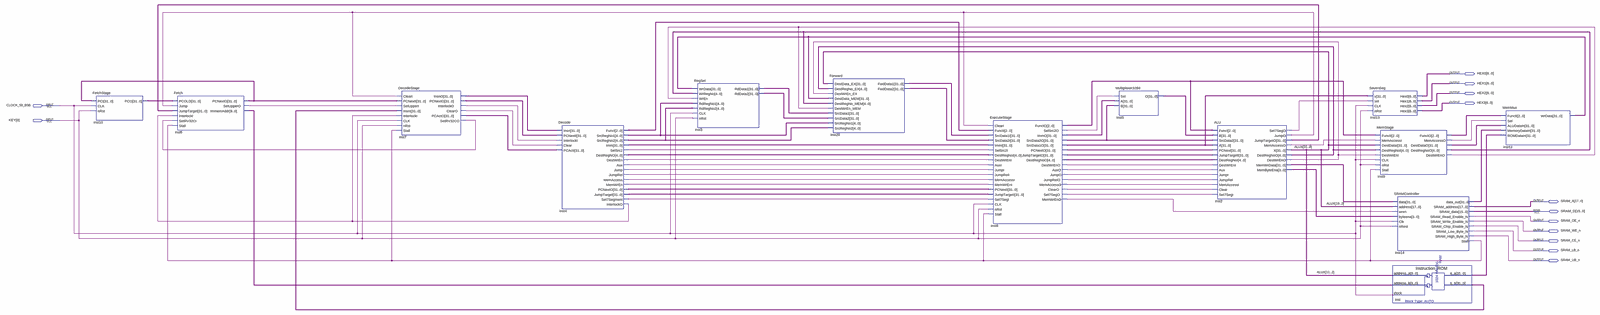
[diagram p0: schematic sheet, whole]
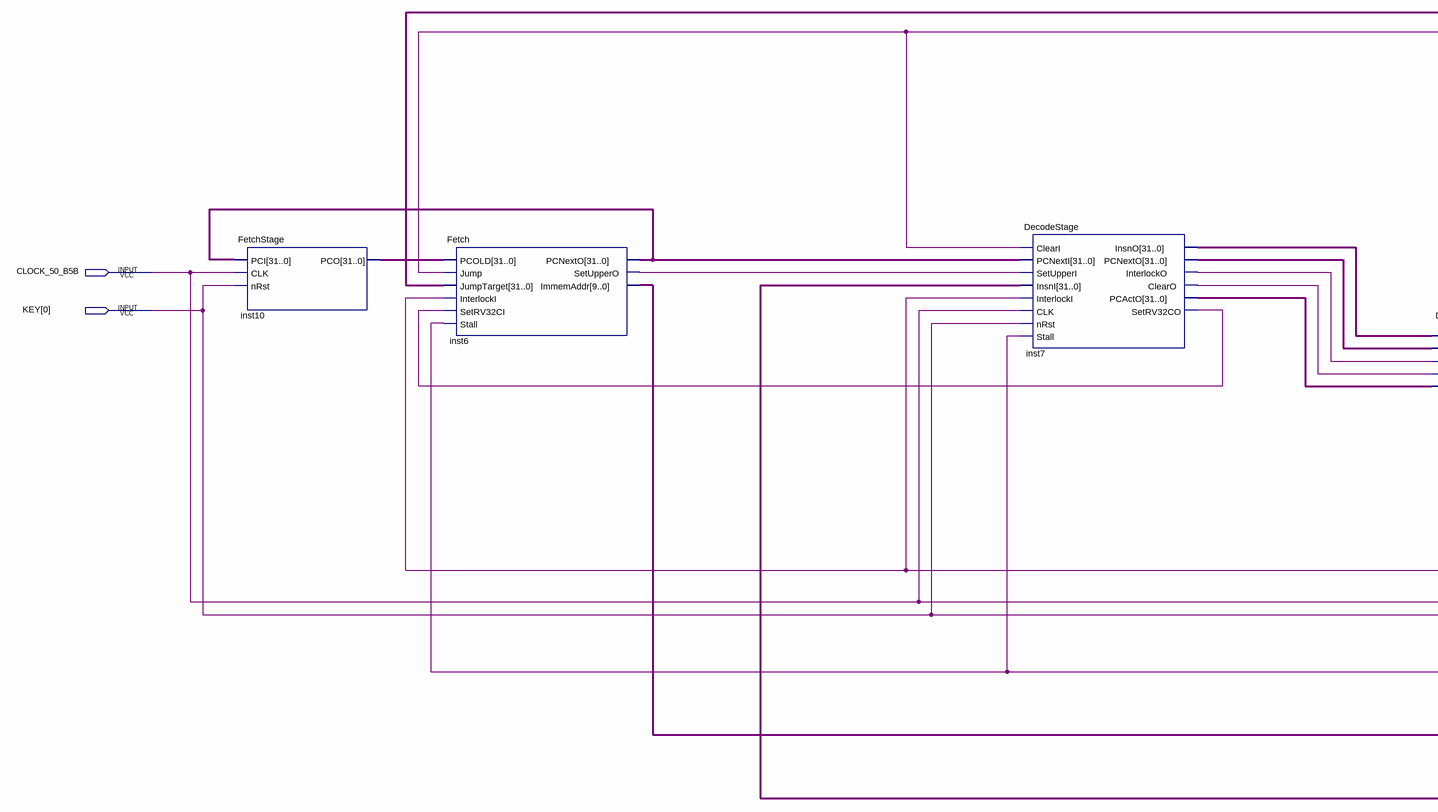
[diagram p1: schematic sheet, left part]
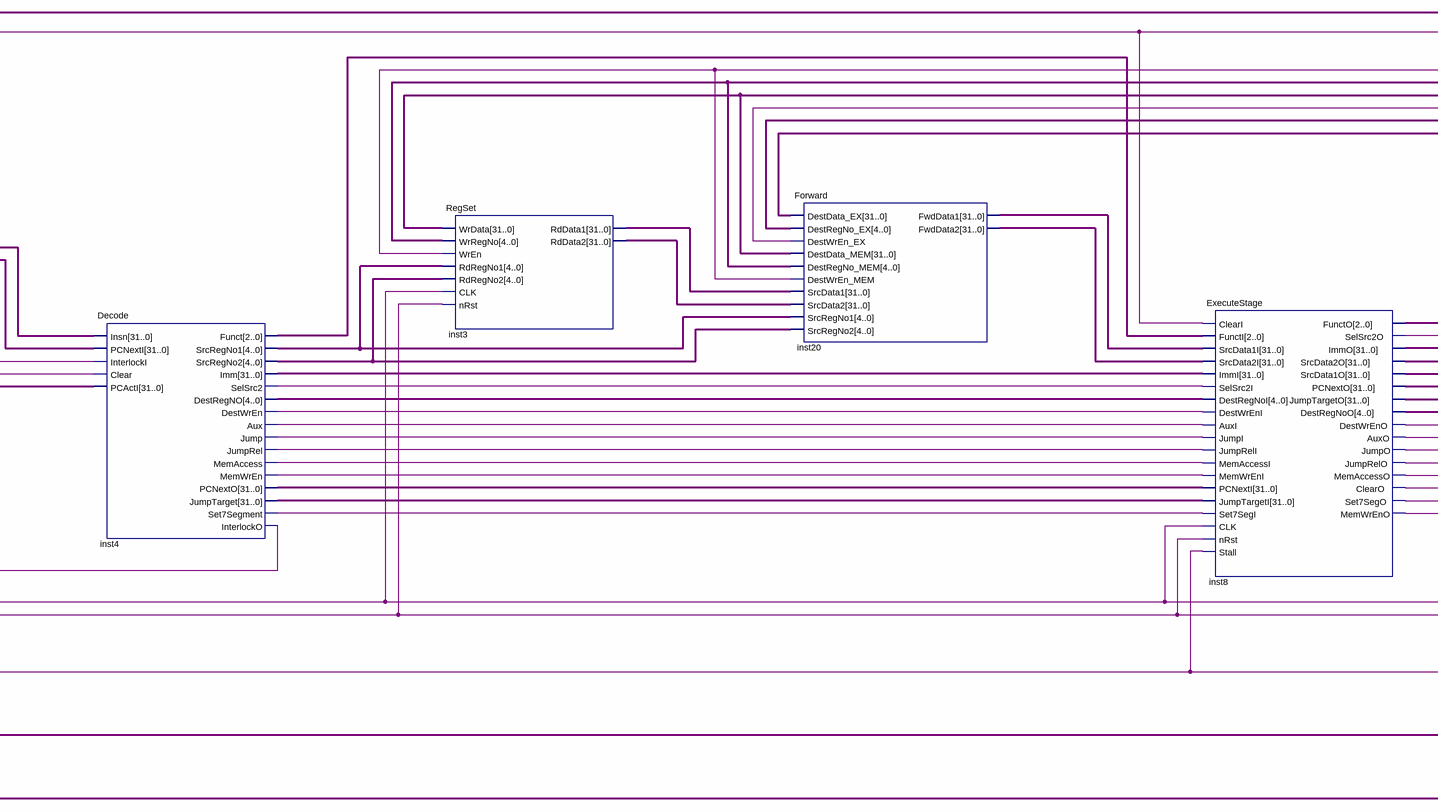
[diagram p2: schematic sheet, centre part]
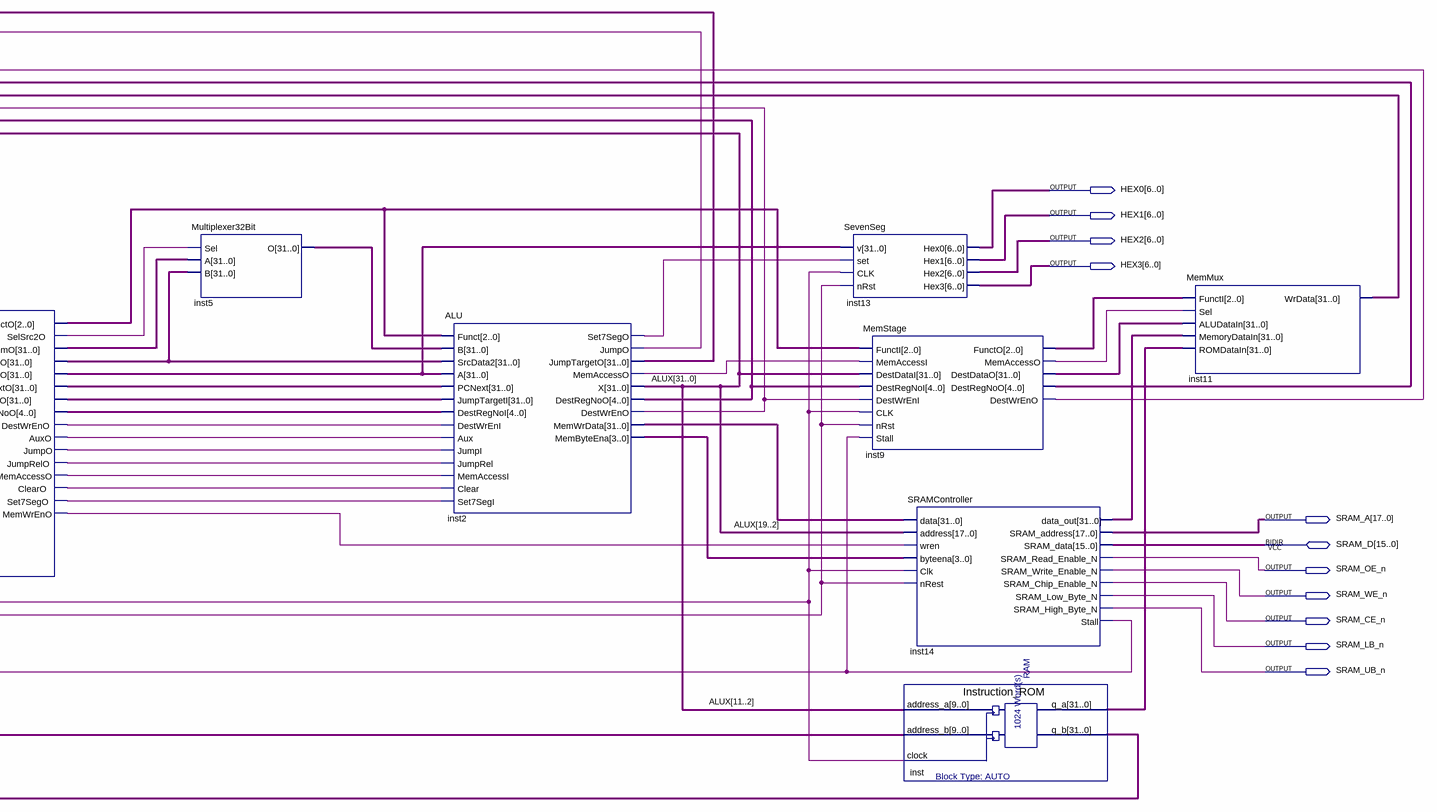
[diagram p3: schematic sheet, right part]
// Quartus schematic RISCV.bdf as structural Verilog: 14 symbols, 13 pins
module RISCV (
  input  CLOCK_50_B5B,
  input  [0:0] KEY,
  inout  [15:0] SRAM_D,
  output [6:0] HEX0,
  output [6:0] HEX1,
  output [6:0] HEX2,
  output [6:0] HEX3,
  output [17:0] SRAM_A,
  output SRAM_OE_n,
  output SRAM_WE_n,
  output SRAM_CE_n,
  output SRAM_LB_n,
  output SRAM_UB_n
);

  wire inst2_destwreno, inst2_jumpo, inst2_memaccesso, inst2_set7sego, inst4_aux, inst4_destwren,
       inst4_interlocko, inst4_jump, inst4_jumprel, inst4_memaccess, inst4_memwren, inst4_selsrc2,
       inst4_set7segment, inst6_setuppero, inst7_clearo, inst7_interlocko, inst7_setrv32co, inst8_auxo,
       inst8_clearo, inst8_destwreno, inst8_jumpo, inst8_jumprelo, inst8_memaccesso, inst8_memwreno,
       inst8_selsrc2o, inst8_set7sego, inst9_destwreno, inst9_memaccesso, inst14_stall;
  wire [2:0] inst4_funct, inst8_functo, inst9_functo;
  wire [3:0] inst2_membyteena;
  wire [4:0] inst2_destregnoo, inst4_destregno, inst4_srcregno1, inst4_srcregno2, inst8_destregnoo,
       inst9_destregnoo;
  wire [9:0] inst6_immemaddr;
  wire [31:0] ALUX, inst2_jumptargeto, inst2_memwrdata, inst3_rddata1, inst3_rddata2, inst4_imm,
       inst4_jumptarget, inst4_pcnexto, inst5_o, inst6_pcnexto, inst7_insno, inst7_pcacto, inst7_pcnexto,
       inst8_immo, inst8_jumptargeto, inst8_pcnexto, inst8_srcdata1o, inst8_srcdata2o, inst9_destdatao,
       inst10_pco, inst11_wrdata, inst14_data_out, inst20_fwddata1, inst20_fwddata2, inst_q_a, inst_q_b;

  FetchStage inst10 (.PCI(inst6_pcnexto), .CLK(CLOCK_50_B5B), .nRst(KEY[0]), .PCO(inst10_pco));
  Fetch inst6 (
    .PCOLD(inst10_pco), .Jump(inst2_jumpo), .JumpTarget(inst2_jumptargeto), .InterlockI(inst4_interlocko),
    .SetRV32CI(inst7_setrv32co), .Stall(inst14_stall), .PCNextO(inst6_pcnexto), .SetUpperO(inst6_setuppero),
    .ImmemAddr(inst6_immemaddr));
  DecodeStage inst7 (
    .ClearI(inst2_jumpo), .PCNextI(inst6_pcnexto), .SetUpperI(inst6_setuppero), .InsnI(inst_q_b),
    .InterlockI(inst4_interlocko), .CLK(CLOCK_50_B5B), .nRst(KEY[0]), .Stall(inst14_stall),
    .InsnO(inst7_insno), .PCNextO(inst7_pcnexto), .InterlockO(inst7_interlocko), .ClearO(inst7_clearo),
    .PCActO(inst7_pcacto), .SetRV32CO(inst7_setrv32co));
  Decode inst4 (
    .Insn(inst7_insno), .PCNextI(inst7_pcnexto), .InterlockI(inst7_interlocko), .Clear(inst7_clearo),
    .PCActI(inst7_pcacto), .Funct(inst4_funct), .SrcRegNo1(inst4_srcregno1), .SrcRegNo2(inst4_srcregno2),
    .Imm(inst4_imm), .SelSrc2(inst4_selsrc2), .DestRegNO(inst4_destregno), .DestWrEn(inst4_destwren),
    .Aux(inst4_aux), .Jump(inst4_jump), .JumpRel(inst4_jumprel), .MemAccess(inst4_memaccess),
    .MemWrEn(inst4_memwren), .PCNextO(inst4_pcnexto), .JumpTarget(inst4_jumptarget),
    .Set7Segment(inst4_set7segment), .InterlockO(inst4_interlocko));
  RegSet inst3 (
    .WrData(inst11_wrdata), .WrRegNo(inst9_destregnoo), .WrEn(inst9_destwreno), .RdRegNo1(inst4_srcregno1),
    .RdRegNo2(inst4_srcregno2), .CLK(CLOCK_50_B5B), .nRst(KEY[0]), .RdData1(inst3_rddata1),
    .RdData2(inst3_rddata2));
  Forward inst20 (
    .DestData_EX(ALUX), .DestRegNo_EX(inst2_destregnoo), .DestWrEn_EX(inst2_destwreno),
    .DestData_MEM(inst11_wrdata), .DestRegNo_MEM(inst9_destregnoo), .DestWrEn_MEM(inst9_destwreno),
    .SrcData1(inst3_rddata1), .SrcData2(inst3_rddata2), .SrcRegNo1(inst4_srcregno1),
    .SrcRegNo2(inst4_srcregno2), .FwdData1(inst20_fwddata1), .FwdData2(inst20_fwddata2));
  ExecuteStage inst8 (
    .ClearI(inst2_jumpo), .FunctI(inst4_funct), .SrcData1I(inst20_fwddata1), .SrcData2I(inst20_fwddata2),
    .ImmI(inst4_imm), .SelSrc2I(inst4_selsrc2), .DestRegNoI(inst4_destregno), .DestWrEnI(inst4_destwren),
    .AuxI(inst4_aux), .JumpI(inst4_jump), .JumpRelI(inst4_jumprel), .MemAccessI(inst4_memaccess),
    .MemWrEnI(inst4_memwren), .PCNextI(inst4_pcnexto), .JumpTargetI(inst4_jumptarget),
    .Set7SegI(inst4_set7segment), .CLK(CLOCK_50_B5B), .nRst(KEY[0]), .Stall(inst14_stall),
    .FunctO(inst8_functo), .SelSrc2O(inst8_selsrc2o), .ImmO(inst8_immo), .SrcData2O(inst8_srcdata2o),
    .SrcData1O(inst8_srcdata1o), .PCNextO(inst8_pcnexto), .JumpTargetO(inst8_jumptargeto),
    .DestRegNoO(inst8_destregnoo), .DestWrEnO(inst8_destwreno), .AuxO(inst8_auxo), .JumpO(inst8_jumpo),
    .JumpRelO(inst8_jumprelo), .MemAccessO(inst8_memaccesso), .ClearO(inst8_clearo),
    .Set7SegO(inst8_set7sego), .MemWrEnO(inst8_memwreno));
  Multiplexer32Bit inst5 (.Sel(inst8_selsrc2o), .A(inst8_immo), .B(inst8_srcdata2o), .O(inst5_o));
  ALU inst2 (
    .Funct(inst8_functo), .B(inst5_o), .SrcData2(inst8_srcdata2o), .A(inst8_srcdata1o),
    .PCNext(inst8_pcnexto), .JumpTargetI(inst8_jumptargeto), .DestRegNoI(inst8_destregnoo),
    .DestWrEnI(inst8_destwreno), .Aux(inst8_auxo), .JumpI(inst8_jumpo), .JumpRel(inst8_jumprelo),
    .MemAccessI(inst8_memaccesso), .Clear(inst8_clearo), .Set7SegI(inst8_set7sego),
    .Set7SegO(inst2_set7sego), .JumpO(inst2_jumpo), .JumpTargetO(inst2_jumptargeto),
    .MemAccessO(inst2_memaccesso), .X(ALUX), .DestRegNoO(inst2_destregnoo), .DestWrEnO(inst2_destwreno),
    .MemWrData(inst2_memwrdata), .MemByteEna(inst2_membyteena));
  SevenSeg inst13 (
    .v(inst8_srcdata1o), .set(inst2_set7sego), .CLK(CLOCK_50_B5B), .nRst(KEY[0]), .Hex0(HEX0), .Hex1(HEX1),
    .Hex2(HEX2), .Hex3(HEX3));
  MemStage inst9 (
    .FunctI(inst8_functo), .MemAccessI(inst2_memaccesso), .DestDataI(ALUX), .DestRegNoI(inst2_destregnoo),
    .DestWrEnI(inst2_destwreno), .CLK(CLOCK_50_B5B), .nRst(KEY[0]), .Stall(inst14_stall),
    .FunctO(inst9_functo), .MemAccessO(inst9_memaccesso), .DestDataO(inst9_destdatao),
    .DestRegNoO(inst9_destregnoo), .DestWrEnO(inst9_destwreno));
  SRAMController inst14 (
    .data(inst2_memwrdata), .address(ALUX[19:2]), .wren(inst8_memwreno), .byteena(inst2_membyteena),
    .Clk(CLOCK_50_B5B), .nRest(KEY[0]), .data_out(inst14_data_out), .SRAM_address(SRAM_A),
    .SRAM_Read_Enable_N(SRAM_OE_n), .SRAM_Write_Enable_N(SRAM_WE_n), .SRAM_Chip_Enable_N(SRAM_CE_n),
    .SRAM_Low_Byte_N(SRAM_LB_n), .SRAM_High_Byte_N(SRAM_UB_n), .Stall(inst14_stall), .SRAM_data(SRAM_D));
  Instruction_ROM inst (
    .address_a(ALUX[11:2]), .address_b(inst6_immemaddr), .clock(CLOCK_50_B5B), .q_a(inst_q_a), .q_b(inst_q_b));
  MemMux inst11 (
    .FunctI(inst9_functo), .Sel(inst9_memaccesso), .ALUDataIn(inst9_destdatao),
    .MemoryDataIn(inst14_data_out), .ROMDataIn(inst_q_a), .WrData(inst11_wrdata));
endmodule
